# EAGLE schematic air-quality (EAGLE 9.6.2)
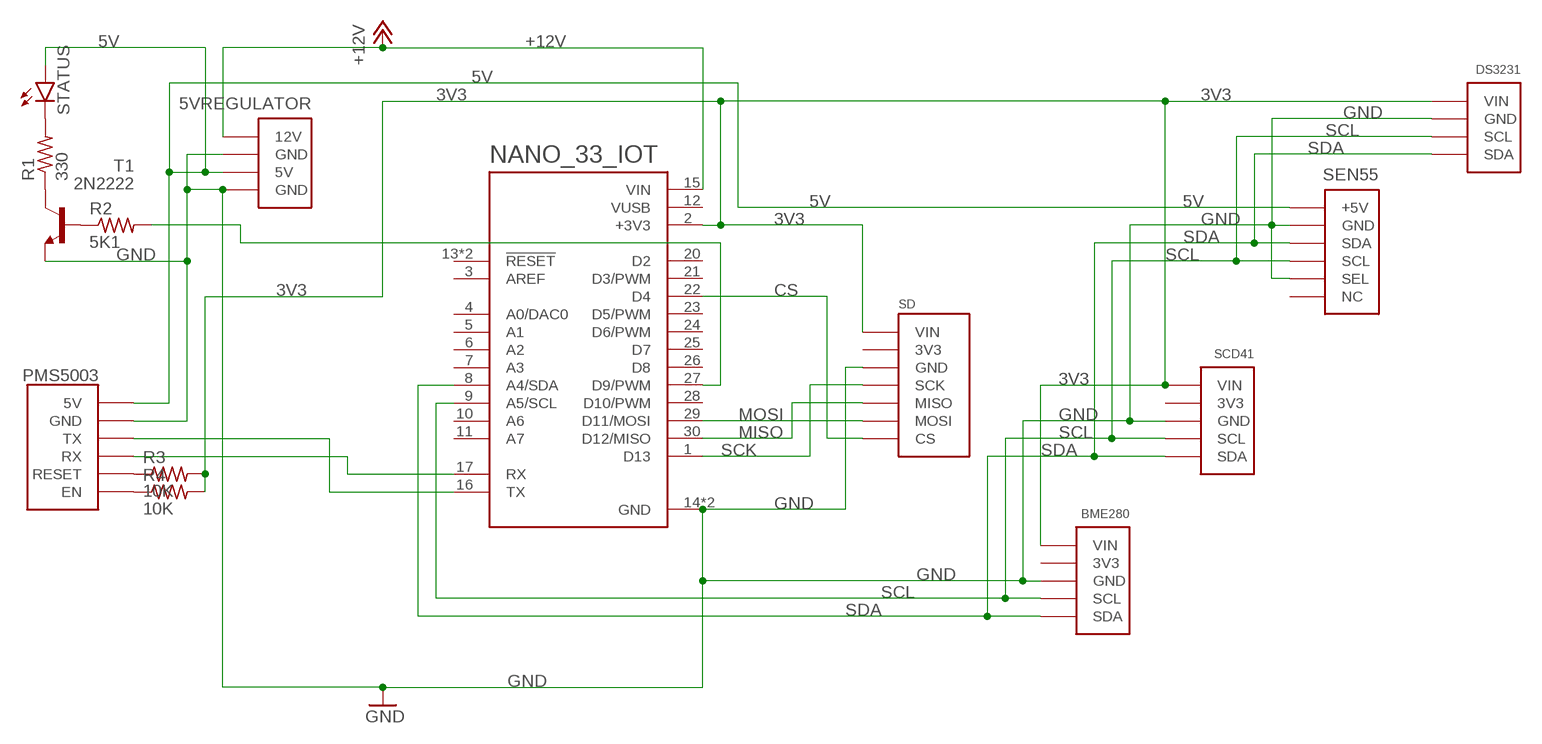
[diagram p0: schematic, sheet 1]

## Parts
5VREGULATOR  BUCKREGULATOR  [BUCKREGULATOR]
BME280  BME280  [BME280]
DS3231  DS3231  [DS3231]
NANO_33_IOT  NANO33IOT  [MODULE_ABX00027]
PMS5003  PMS5003  [PMS5003]
R1  330  R-US_0309/10  [0309/10]
R2  5K1  R-US_0309/10  [0309/10]
R3  10K  R-US_0309/10  [0309/10]
R4  10K  R-US_0309/10  [0309/10]
SCD41  SCD41  [SCD41]
SD  MICROSD  [MICROSD]
SEN55  SEN55  [SEN55]
STATUS  LED5MM  [LED5MM]
T1  2N2222  [TO18]

## Nets
3V3: BME280.P$5(VIN) DS3231.P$4(VIN) NANO_33_IOT.2(+3V3) R3.2 R4.2 SCD41.P$5(VIN) SD.7(VIN)
5V: 5VREGULATOR.3(5V) PMS5003.1(5V) SEN55.1(+5V) STATUS.A
+12V: 5VREGULATOR.1(12V) NANO_33_IOT.15(VIN)
CS: NANO_33_IOT.22(D4) SD.2(CS)
GND: 5VREGULATOR.2(GND) 5VREGULATOR.4(GND) BME280.P$2(GND) DS3231.P$1(GND) NANO_33_IOT.14(GND) NANO_33_IOT.19(GND) PMS5003.2(GND) SCD41.P$2(GND) SD.3(GND) SEN55.2(GND) SEN55.5(SEL) T1.1(E)
MISO: NANO_33_IOT.30(D12/MISO) SD.4(MISO)
MOSI: NANO_33_IOT.29(D11/MOSI) SD.5(MOSI)
N$1: R1.1 T1.3(C)
N$3: NANO_33_IOT.16(TX) PMS5003.3(TX)
N$4: NANO_33_IOT.17(RX) PMS5003.4(RX)
N$5: R2.1 T1.2(B)
N$6: PMS5003.5(RESET) R3.1
N$7: PMS5003.6(EN) R4.1
N$9: R1.2 STATUS.K(C)
N$11: NANO_33_IOT.27(D9/PWM) R2.2
SCK: NANO_33_IOT.1(D13) SD.6(SCK)
SCL: BME280.P$3(SCL) DS3231.P$2(SCL) NANO_33_IOT.9(A5/SCL) SCD41.P$3(SCL) SEN55.4(SCL)
SDA: BME280.P$4(SDA) DS3231.P$3(SDA) NANO_33_IOT.8(A4/SDA) SCD41.P$4(SDA) SEN55.3(SDA)
Unconnected: BME280.P$1(3V3) NANO_33_IOT.3(AREF) NANO_33_IOT.4(A0/DAC0) NANO_33_IOT.5(A1) NANO_33_IOT.6(A2) NANO_33_IOT.7(A3) NANO_33_IOT.10(A6) NANO_33_IOT.11(A7) NANO_33_IOT.13(!RESET) NANO_33_IOT.18(!RESET) NANO_33_IOT.20(D2) NANO_33_IOT.21(D3/PWM) NANO_33_IOT.23(D5/PWM) NANO_33_IOT.24(D6/PWM) NANO_33_IOT.25(D7) NANO_33_IOT.26(D8) NANO_33_IOT.28(D10/PWM) SCD41.P$1(3V3) SD.1(3V3) SEN55.6(NC)

## Power pins joined to a net without a drawn wire
VUSB: NANO_33_IOT.12(VUSB)

## Library data of the parts
5VREGULATOR = airqualityparts:BUCKREGULATOR
BME280 = airqualityparts:BME280
DS3231 = airqualityparts:DS3231
NANO_33_IOT = ABX00027:NANO33IOT: ATSAMD21G18A Arduino Nano 33 IoT SAM D ARM® Cortex®-M0+ MCU 32-Bit Embedded Evaluation Board Check availability <https://pricing.snapeda.com/parts/Arduino%20Nano%2033%20IoT/Arduino/view-part?ref=eda>; AVAILABILITY: Not in stock; DESCRIPTION: An IoT connected IMU sensor in the Nano form factor.; MF: Arduino; MP: Arduino Nano 33 IoT; PACKAGE: None; PRICE: None
PMS5003 = airqualityparts:PMS5003: PMS5003 header from pimoroni.com
R1-R4 = rcl:R-US_: RESISTOR, American symbol; SPICEPREFIX: R
SCD41 = airqualityparts:SCD41
SD = airqualityparts:MICROSD
SEN55 = airqualityparts:SEN55
STATUS = led:LED: LED OSRAM: - CHIPLED LG R971, LG N971, LY N971, LG Q971, LY Q971, LO R971, LY R971 LH N974, LH R974 LS Q976, LO Q976, LY Q976 LO Q996 - Hyper CHIPLED LW Q18S LB Q993, LB Q99A, LB R99A - SideLED LS A670, LO A670, LY A670, LG A670, LP A670 LB A673, LV A673, LT A673, LW A673 LH A674 LY A675 LS A676, LA A676, LO A676, LY A676, LW A676 LS A679, LY A679, LG A679 - Hyper Micro SIDELED® LS Y876, LA Y876, LO Y876, LY Y876 LT Y87S - SmartLED LW L88C, LW L88S LB L89C, LB L89S, LG L890 LS L89K, LO L89K, LY L89K LS L896, LA L896, LO L896, LY L896 - TOPLED LS T670, LO T670, LY T670, LG T670, LP T670 LSG T670, LSP T670, LSY T670, LOP T670, LYG T670 LG T671, LOG T671, LSG T671 LB T673, LV T673, LT T673, LW T673 LH T674 LS T676, LA T676, LO T676, LY T676, LB T676, LH T676, LSB T676, LW T676 LB T67C, LV T67C, LT T67C, LS T67K, LO T67K, LY T67K, LW E67C LS E67B, LA E67B, LO E67B, LY E67B, LB E67C, LV E67C, LT E67C LW T67C LS T679, LY T679, LG T679 LS T770, LO T770, LY T770, LG T770, LP T770 LB T773, LV T773, LT T773, LW T773 LH T774 LS E675, LA E675, LY E675, LS T675 LS T776, LA T776, LO T776, LY T776, LB T776 LHGB T686 LT T68C, LB T68C - Hyper Mini TOPLED® LB M676 - Mini TOPLED Santana® LG M470 LS M47K, LO M47K, LY M47K Source: http://www.osram.convergy.de LUXEON: - LUMILED® LXK2-PW12-R00, LXK2-PW12-S00, LXK2-PW14-U00, LXK2-PW14-V00 LXK2-PM12-R00, LXK2-PM12-S00, LXK2-PM14-U00 LXK2-PE12-Q00, LXK2-PE12-R00, LXK2-PE12-S00, LXK2-PE14-T00, LXK2-PE14-U00 LXK2-PB12-K00, LXK2-PB12-L00, LXK2-PB12-M00, LXK2-PB14-N00, LXK2-PB14-P00, LXK2-PB14-Q00 LXK2-PR12-L00, LXK2-PR12-M00, LXK2-PR14-Q00, LXK2-PR14-R00 LXK2-PD12-Q00, LXK2-PD12-R00, LXK2-PD12-S00 LXK2-PH12-R00, LXK2-PH12-S00 LXK2-PL12-P00, LXK2-PL12-Q00, LXK2-PL12-R00 Source: www.luxeon.com KINGBRIGHT: KA-3528ASYC Source: www.kingbright.com
T1 = transistor:2N2222: NPN TRANSISTOR